# Altium project Servo-Board-v1.0.PrjPcb (part 4 of 19)

## Sheet Connector_Sheet.SchDoc
size 420 x 297 mm; SheetNumber: 8; SheetTotal: 32
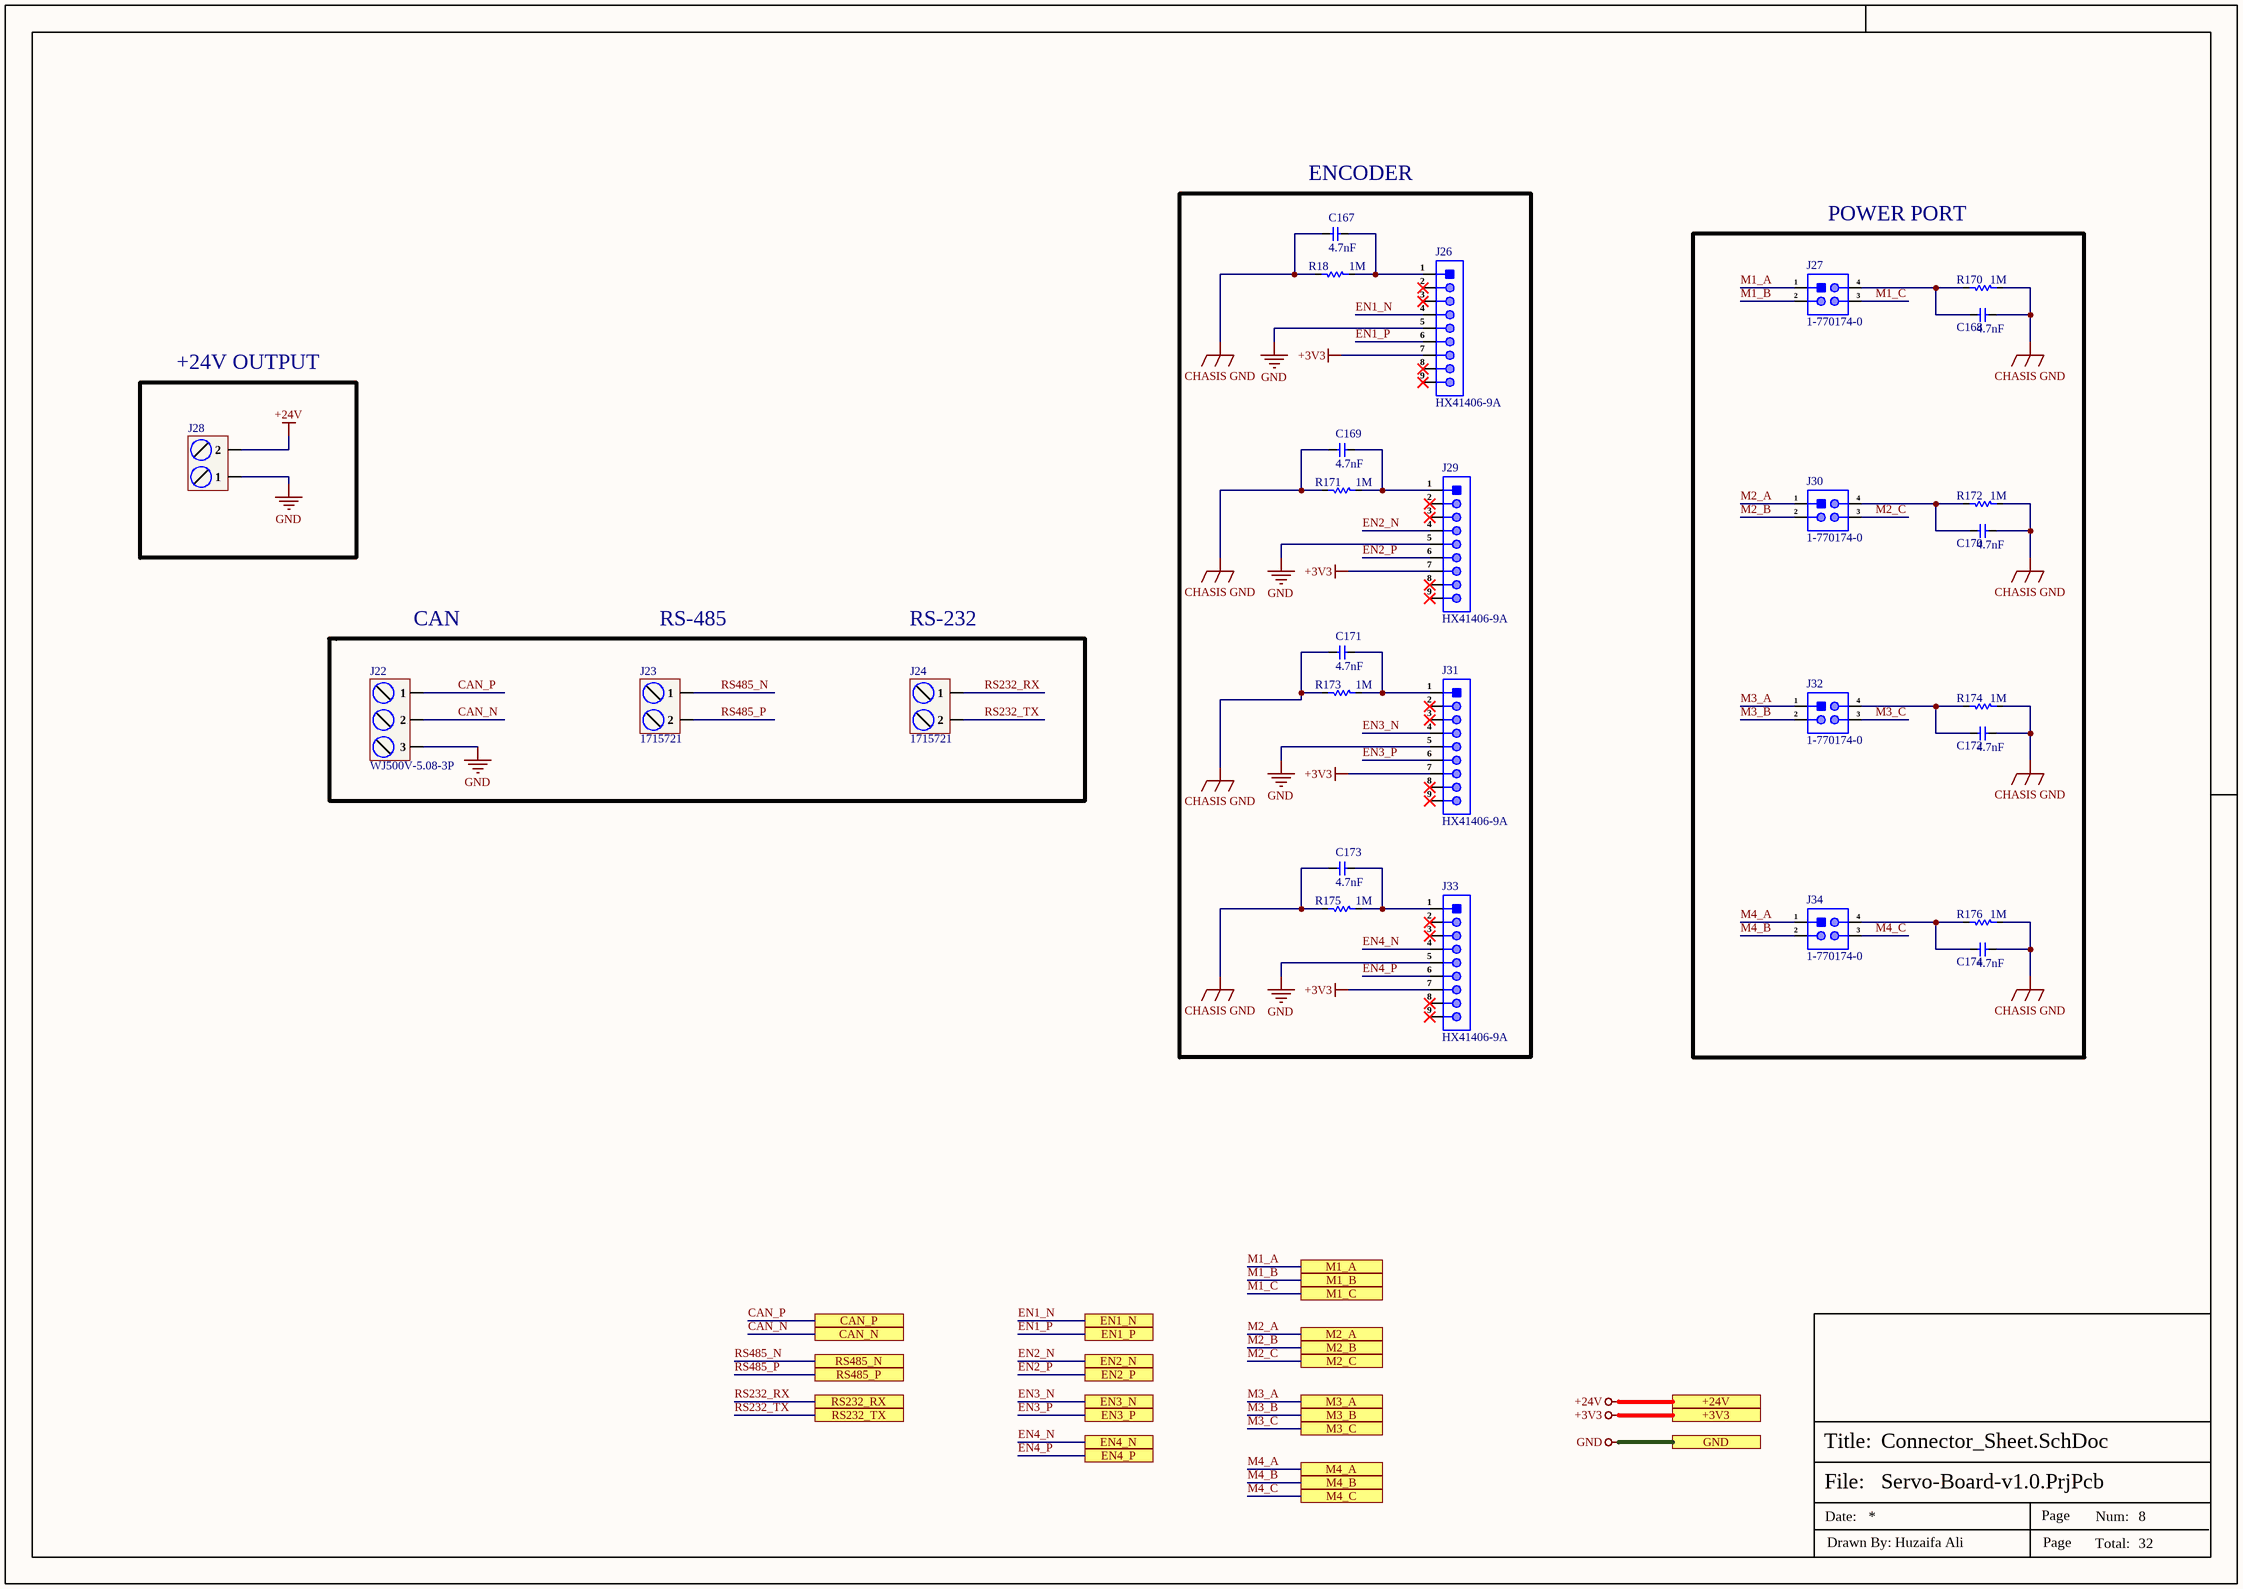
[diagram p7: Connector_Sheet.SchDoc]

### Parts
C167  4.7nF  [Cap-0603]
C168  4.7nF  [Cap-0603]
C169  4.7nF  [Cap-0603]
C170  4.7nF  [Cap-0603]
C171  4.7nF  [Cap-0603]
C172  4.7nF  [Cap-0603]
C173  4.7nF  [Cap-0603]
C174  4.7nF  [Cap-0603]
J22  WJ500V-5.08-3P  [WJ500V-5.08-3P]
J23  1715721  [1715721]
J24  1715721  [1715721]
J26  HX41406-9A  [HX41406-9A]
J27  1-770174-0  [1-770174-0]
J28  MXHB9500-9.5-02P-BK01-Cu-S-A  [MXHB9500-9.5-02P-BK01-Cu-S-A]  (value not drawn)
J29  HX41406-9A  [HX41406-9A]
J30  1-770174-0  [1-770174-0]
J31  HX41406-9A  [HX41406-9A]
J32  1-770174-0  [1-770174-0]
J33  HX41406-9A  [HX41406-9A]
J34  1-770174-0  [1-770174-0]
R18  1M  [Res-0402]
R170  1M  [Res-0402]
R171  1M  [Res-0402]
R172  1M  [Res-0402]
R173  1M  [Res-0402]
R174  1M  [Res-0402]
R175  1M  [Res-0402]
R176  1M  [Res-0402]

### Blocks framed on the sheet
ENCODER: C167 C169 C171 C173 J26 J29 J31 J33 R18 R171 R173 R175
POWER PORT: C168 C170 C172 C174 J27 J30 J32 J34 R170 R172 R174 R176

### Ports
+3V3 (see Top_Sheet[1A], CAN_Sheet[5D], Controller_Sheet[5D], Encoder_Sheet1[5D], Encoder_Sheet2[5D], Encoder_Sheet3[5D], Encoder_Sheet4[5D], EtherCAT_Sheet[5D], Motor_Driver_Sheet1[5D], Motor_Driver_Sheet2[5D], Motor_Driver_Sheet3[5D], Motor_Driver_Sheet4[5D], Power_Sheet[5D], RJ45_Sheet[5D], RS485_RS232_Sheet[3D], Sec_Controller_Sheet1[5D], Sec_Controller_Sheet2[5D], Sec_Controller_Sheet3[5D], Sec_Controller_Sheet4[5D]), +24V (see Top_Sheet[1A], DIO_1[5D], DIO_2[5D], DIO_3[5D], DIO_4[5D], MOSFET_Driver_Sheet1[5D], MOSFET_Driver_Sheet2[5D], MOSFET_Driver_Sheet3[5D], MOSFET_Driver_Sheet4[5D], Motor_Driver_Sheet1[5D], Motor_Driver_Sheet2[5D], Motor_Driver_Sheet3[5D], Motor_Driver_Sheet4[5D], Power_Sheet[5D]), CAN_N, CAN_P, EN1_N (see Top_Sheet[2B], Encoder_Sheet1[2D], Servo1[3D]), EN1_P (see Top_Sheet[2B], Encoder_Sheet1[2D], Servo1[3C]), EN2_N (see Top_Sheet[2B], Encoder_Sheet2[2D], Servo2[2D]), EN2_P (see Top_Sheet[2B], Encoder_Sheet2[2D], Servo2[2C]), EN3_N (see Top_Sheet[2B], Encoder_Sheet3[2D], Servo3[2D]), EN3_P (see Top_Sheet[2B], Encoder_Sheet3[2D], Servo3[2C]), EN4_N (see Top_Sheet[2B], Encoder_Sheet4[2D], Servo4[2D]), EN4_P (see Top_Sheet[2B], Encoder_Sheet4[2D], Servo4[2C]), GND (see Top_Sheet[1A], CAN_Sheet[5D], Controller_Sheet[5D], DIO_1[5D], DIO_2[5D], DIO_3[5D], DIO_4[5D], Encoder_Sheet1[5D], Encoder_Sheet2[5D], Encoder_Sheet3[5D], Encoder_Sheet4[5D], EtherCAT_Sheet[5D], MOSFET_Driver_Sheet1[5D], MOSFET_Driver_Sheet2[5D], MOSFET_Driver_Sheet3[5D], MOSFET_Driver_Sheet4[5D], Motor_Driver_Sheet1[5D], Motor_Driver_Sheet2[5D], Motor_Driver_Sheet3[5D], Motor_Driver_Sheet4[5D], Power_Sheet[5D], RJ45_Sheet[5D], RS485_RS232_Sheet[3D], Sec_Controller_Sheet1[5D], Sec_Controller_Sheet2[5D], Sec_Controller_Sheet3[5D], Sec_Controller_Sheet4[5D]), M1_A (see Top_Sheet[1B], MOSFET_Driver_Sheet1[4D], Servo1[5B]), M1_B (see Top_Sheet[1B], MOSFET_Driver_Sheet1[4D], Servo1[5B]), M1_C (see Top_Sheet[1B], MOSFET_Driver_Sheet1[4D], Servo1[5B]), M2_A (see Top_Sheet[1B], MOSFET_Driver_Sheet2[3D], Servo2[5B]), M2_B (see Top_Sheet[1B], MOSFET_Driver_Sheet2[3D], Servo2[5B]), M2_C (see Top_Sheet[1B], MOSFET_Driver_Sheet2[3D], Servo2[5B]), M3_A (see Top_Sheet[1B], MOSFET_Driver_Sheet3[3D], Servo3[5B]), M3_B (see Top_Sheet[1B], MOSFET_Driver_Sheet3[3D], Servo3[5B]), M3_C (see Top_Sheet[1B], MOSFET_Driver_Sheet3[3D], Servo3[5B]), M4_A (see Top_Sheet[1B], MOSFET_Driver_Sheet4[3D], Servo4[5B]), M4_B (see Top_Sheet[1B], MOSFET_Driver_Sheet4[3D], Servo4[5B]), M4_C (see Top_Sheet[1B], MOSFET_Driver_Sheet4[3D], Servo4[5B]), RS232_RX (see Top_Sheet[1A], RS485_RS232_Sheet[5D]), RS232_TX (see Top_Sheet[1A], RS485_RS232_Sheet[5D]), RS485_N (see Top_Sheet[1A], RS485_RS232_Sheet[5D]), RS485_P (see Top_Sheet[1A], RS485_RS232_Sheet[5D])

### Nets
+3V3: J26.7 J29.7 J31.7 J33.7 ; port +3V3
+24V: J28.2 ; port +24V  [project net VDRAIN]
CHASIS GND: C167.2 C168.2 C169.2 C170.2 C171.2 C172.2 C173.2 C174.2 R18.1 R170.2 R171.1 R172.2 R173.1 R174.2 R175.1 R176.2
GND: J22.3 J26.5 J28.1 J29.5 J31.5 J33.5 ; port GND
RS232_RX: J24.1 ; port RS232_RX
RS232_TX: J24.2 ; port RS232_TX
CAN_N: J22.2 ; port CAN_N
CAN_P: J22.1 ; port CAN_P
EN1_N: J26.4 ; port EN1_N
EN1_P: J26.6 ; port EN1_P
EN2_N: J29.4 ; port EN2_N
EN2_P: J29.6 ; port EN2_P
EN3_N: J31.4 ; port EN3_N
EN3_P: J31.6 ; port EN3_P
EN4_N: J33.4 ; port EN4_N
EN4_P: J33.6 ; port EN4_P
M1_A: J27.1 ; port M1_A
M1_B: J27.2 ; port M1_B
M1_C: J27.3 ; port M1_C
M2_A: J30.1 ; port M2_A
M2_B: J30.2 ; port M2_B
M2_C: J30.3 ; port M2_C
M3_A: J32.1 ; port M3_A
M3_B: J32.2 ; port M3_B
M3_C: J32.3 ; port M3_C
M4_A: J34.1 ; port M4_A
M4_B: J34.2 ; port M4_B
M4_C: J34.3 ; port M4_C
RS485_N: J23.1 ; port RS485_N
RS485_P: J23.2 ; port RS485_P
NetC167_1: C167.1 J26.1 R18.2
NetC168_1: C168.1 J27.4 R170.1
NetC169_1: C169.1 J29.1 R171.2
NetC170_1: C170.1 J30.4 R172.1
NetC171_1: C171.1 J31.1 R173.2
NetC172_1: C172.1 J32.4 R174.1
NetC173_1: C173.1 J33.1 R175.2
NetC174_1: C174.1 J34.4 R176.1

Not connected (* = marked no-connect by the designer): J26 2* 3* 8* 9*; J29 2* 3* 8* 9*; J31 2* 3* 8* 9*; J33 2* 3* 8* 9*

### Notes on the sheet
- +24V OUTPUT
- CAN
- RS-485
- RS-232
- File:
- Title:
- Date:
- Page
- Num:
- Total:
- Drawn By: Huzaifa Ali

### Library data of the parts
C167-C174 = CC0603JRNPO9BN472: CAP CER 4700PF 50V C0G/NPO 0603; Manufacturer: Yageo; Item Type: Capacitor; Supplier 1: Digi-Key; Manufacturer Part Number: CC0603JRNPO9BN472; RoHS: Yes; Category: Ceramic Capacitors; Stock 1: 31779; Pricing 1: 1=0.48000, 10=0.33000, 50=0.23100, 100=0.19800, 500=0.14854, 1000=0.12543 (USD); RoHS Compliant: Yes; Supplier Part Number 1: 13-CC0603JRNPO9BN472CT-ND; LCSC Part Number: C576818; ComponentLink1Description: LCSC; ComponentLink1URL: https://www.lcsc.com/product-detail/Multilayer-Ceramic-Capacitors-MLCC-SMD-SMT_YAGEO-CC0603JRNPO9BN472_C576818.html
J22 = WJ500V-5.08-3P: 1x3P 18A -40℃~+105℃ 250V Green 14~30 Straight pin 5.08mm 2.5 1 3 Plugin,P=5.08mm Screw terminal ROHS; Manufacturer: Ningbo Kangnex Elec; Item Type: Terminal Block; Manufacturer Part Number: WJ500V-5.08-3P; Package: Plugin,P=5.08mm; LCSC Part Number: C72334; ComponentLink1Description: LCSC; ComponentLink1URL: https://www.lcsc.com/product-detail/Screw-terminal_Ningbo-Kangnex-Elec-WJ500V-5-08-3P_C72334.html
J23 J24 = 1715721: TERM BLK 2P SIDE ENT 5.08MM PCB; Manufacturer: Phoenix Contact; Item Type: Terminal Blocks; Supplier: Digikey; Supplier Part Number: 277-1263-ND; Manufacturer Part Number: 1715721; RoHS: Yes; Stock: 13160; Pricing: 1=0.94 (USD); ComponentLink1URL: https://datasheet.ciiva.com/1120/1697161-1120393.pdf?src-supplier=Farnell; ComponentLink1Description: https://datasheet.ciiva.com/1120/1697161-1120393.pdf?src-supplier=Farnell; ComponentLink2URL: https://datasheet.ciiva.com/832/1715721-832095.pdf?src-supplier=Digikey; ComponentLink2Description: https://datasheet.ciiva.com/832/1715721-832095.pdf?src-supplier=Digikey; ComponentLink3URL: https://datasheet.ciiva.com/15169/getdatasheetpartid-212174-15169929.pdf?src-supplier=Verical; ComponentLink3Description: https://datasheet.ciiva.com/15169/getdatasheetpartid-212174-15169929.pdf?src-supplier=Verical; ComponentLink4URL: https://datasheet.ciiva.com/16046/1715721-16046034.pdf?src-supplier=Onlinecomponents.com; ComponentLink4Description: https://datasheet.ciiva.com/16046/1715721-16046034.pdf?src-supplier=Onlinecomponents.com
J26 J29 J31 J33 = HX41406-9A: 3x3P 9P 3 4.14mm 4.14mm 3 -25℃~+105℃ 8A Straight Plugin,P=4.14mm Wire To Board Connector ROHS; Manufacturer: HX(Zhejiang Yueqing Hongxing Elec); Manufacturer Part Number: HX41406-9A; Package: Plugin,P=4.14mm; LCSC Part Number: C704507; Item Type: Wire To Board Connector; ComponentLink1Description: LCSC; ComponentLink1URL: https://www.lcsc.com/product-detail/Wire-To-Board-Connector_HX-Zhejiang-Yueqing-Hongxing-Elec-HX41406-9A_C704507.html
J27 J30 J32 J34 = 1-770174-0: CONN HEADER VERT 4POS 4.14MM; Manufacturer: TE Connectivity; Item Type: Power Connectors; Supplier: Future Electronics; Supplier Part Number: 3310547; Manufacturer Part Number: 1-770174-0; RoHS: Yes; Stock: 890; Pricing: 1=0.995, 30=1.04, 40=0.945, 125=0.91, 300=0.95, 400=0.87, 1250=0.8 (USD); ComponentLink1URL: https://datasheet.ciiva.com/19460/746478-19460823.pdf?src-supplier=Jameco; ComponentLink1Description: https://datasheet.ciiva.com/19460/746478-19460823.pdf?src-supplier=Jameco; ComponentLink2URL: https://datasheet.ciiva.com/11755/0900766b80b8608c-11755178.pdf?src-supplier=Rs; ComponentLink2Description: https://datasheet.ciiva.com/11755/0900766b80b8608c-11755178.pdf?src-supplier=Rs; ComponentLink3URL: https://datasheet.ciiva.com/16324/eng-cs-82181-softshell-high-density-0508-16324224.pdf?src-supplier=Future+Electronics; ComponentLink3Description: https://datasheet.ciiva.com/16324/eng-cs-82181-softshell-high-density-0508-16324224.pdf?src-supplier=Future+Electronics; ComponentLink4URL: https://datasheet.ciiva.com/1111/eng-cd-770174-l2-1111782.pdf?src-supplier=Element14; ComponentLink4Description: https://datasheet.ciiva.com/1111/eng-cd-770174-l2-1111782.pdf?src-supplier=Element14; ComponentLink5URL: https://datasheet.ciiva.com/15173/getdatasheetpartid-47574-15173655.pdf?src-supplier=Verical; ComponentLink5Description: https://datasheet.ciiva.com/15173/getdatasheetpartid-47574-15173655.pdf?src-supplier=Verical; ComponentLink6URL: https://datasheet.ciiva.com/710/eng-cd-770174-m-710026.pdf?src-supplier=Digikey; ComponentLink6Description: https://datasheet.ciiva.com/710/eng-cd-770174-m-710026.pdf?src-supplier=Digikey; ComponentLink7URL: https://datasheet.ciiva.com/3126/eng-cs-82181-softshell-high-density-0408-3126092.pdf?src-supplier=Avnet; ComponentLink7Description: https://datasheet.ciiva.com/3126/eng-cs-82181-softshell-high-density-0408-3126092.pdf?src-supplier=Avnet; ComponentLink8URL: https://datasheet.ciiva.com/30189/eng-cs-82181-softshell-high-density-0508-30189644.pdf?src-supplier=Onlinecomponents.com; ComponentLink8Description: https://datasheet.ciiva.com/30189/eng-cs-82181-softshell-high-density-0508-30189644.pdf?src-supplier=Onlinecomponents.com; ComponentLink9URL: https://datasheet.ciiva.com/29266/745091-da-01-en-4-pol-mini-univ-mate-n-lok-stecksockel-29266107.pdf?src-supplier=Conrad; ComponentLink9Description: https://datasheet.ciiva.com/29266/745091-da-01-en-4-pol-mini-univ-mate-n-lok-stecksockel-29266107.pdf?src-supplier=Conrad
J28 = MXHB9500-9.5-02P-BK01-Cu-S-A: Tin 1x2P Corner pin Three sides 2 1 9.5mm -40℃~+105℃ 20A 300V Black 10~22 Copper Alloy 0.5~4 Plugin,P=9.5mm Barrier Terminal Blocks ROHS; Manufacturer: MAX; Manufacturer Part Number: MXHB9500-9.5-02P-BK01-Cu-S-A; Package: Plugin,P=9.5mm; LCSC Part Number: C7542168; Item Type: Terminal Block; ComponentLink1Description: LCSC; ComponentLink1URL: https://www.lcsc.com/product-detail/Barrier-Terminal-Blocks_MAX-MXHB9500-9-5-02P-BK01-Cu-S-A_C7542168.html
R18 R170-R176 = AF0402JR-071ML: RES SMD 1M OHM 5% 1/16W 0402; Manufacturer: Yageo; Resistance: 1MR; Max Power Dissipation: 63mW; Temperature Coefficient: 100ppm/°C; Item Type: Resistor; Supplier 1: Digi-Key; Manufacturer Part Number: AF0402JR-071ML; Stock 1: 0; Pricing 1: 10000=0.00408 (USD); Case/Package: 0402; Min Operating Temperature: -55°C; Max Operating Temperature: 155°C; Packaging: Tape and Reel; Resistor Type: Thick Film; Number of Terminations: 2; Tolerance: 5%; Features: Moisture Resistant,Anti-Sulfur; Length: 0.039inch; Width: 0.02inch; Height: 0.015inch; RoHS Compliant: Yes; ComponentLink1URL: https://www.yageo.com/upload/media/product/productsearch/datasheet/rchip/PYu-AF_51_RoHS_L_6.pdf?src-supplier=Digi-Key; ComponentLink1Description: https://www.yageo.com/upload/media/product/productsearch/datasheet/rchip/PYu-AF_51_RoHS_L_6.pdf?src-supplier=Digi-Key; Supplier Part Number 1: AF0402JR-071ML-ND; LCSC Part Number: C144054

## Sheet Servo1.SchDoc
size 420 x 297 mm; SheetNumber: 9; SheetTotal: 32
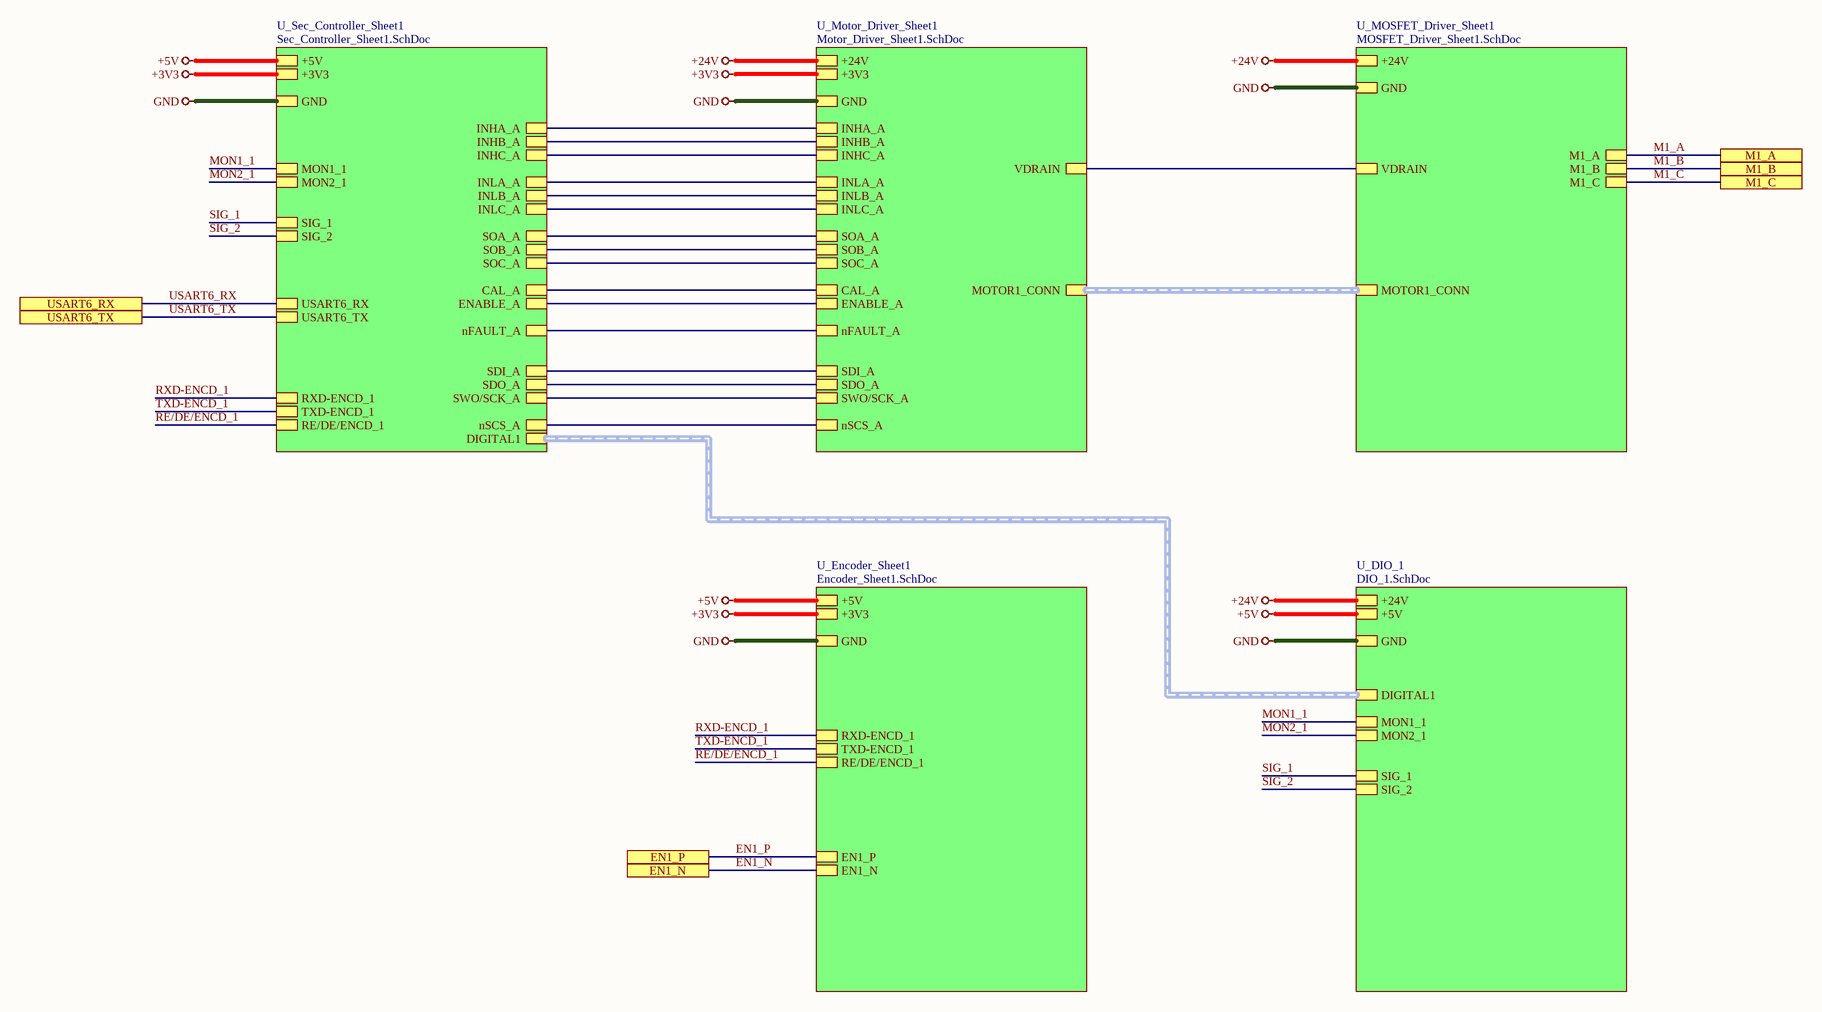
[diagram p8: Servo1.SchDoc]

### Sub-sheets
U_DIO_1 = DIO_1.SchDoc: +24V, +5V, GND, MON1_1, MON2_1, SIG_1, SIG_2, DIGITAL1 (harness DIGITAL1)
U_Encoder_Sheet1 = Encoder_Sheet1.SchDoc: +3V3, +5V, GND, RXD-ENCD_1, TXD-ENCD_1, RE/DE/ENCD_1, EN1_N, EN1_P
U_MOSFET_Driver_Sheet1 = MOSFET_Driver_Sheet1.SchDoc: +24V, GND, M1_A, M1_B, M1_C, MOTOR1_CONN (harness MOTOR1_CONN), VDRAIN
U_Motor_Driver_Sheet1 = Motor_Driver_Sheet1.SchDoc: +24V, +3V3, GND, MOTOR1_CONN (harness MOTOR1_CONN), INHA_A, INHB_A, INHC_A, INLA_A, INLB_A, INLC_A, nSCS_A, SDI_A, SDO_A, SWO/SCK_A, SOC_A, SOB_A, SOA_A, CAL_A, ENABLE_A, VDRAIN, nFAULT_A
U_Sec_Controller_Sheet1 = Sec_Controller_Sheet1.SchDoc: +3V3, GND, INHA_A, INHB_A, INHC_A, INLA_A, INLB_A, INLC_A, nSCS_A, SDI_A, SDO_A, SWO/SCK_A, SOC_A, SOB_A, SOA_A, CAL_A, ENABLE_A, nFAULT_A, USART6_RX, USART6_TX, RXD-ENCD_1, TXD-ENCD_1, RE/DE/ENCD_1, MON1_1, MON2_1, SIG_1, SIG_2, DIGITAL1 (harness DIGITAL1), +5V

### Ports
EN1_N (see Top_Sheet[4A], Connector_Sheet[3D], Encoder_Sheet1[2D]), EN1_P (see Top_Sheet[4A], Connector_Sheet[3D], Encoder_Sheet1[2D]), M1_A (see Top_Sheet[4B], Connector_Sheet[4D], MOSFET_Driver_Sheet1[4D]), M1_B (see Top_Sheet[4B], Connector_Sheet[4D], MOSFET_Driver_Sheet1[4D]), M1_C (see Top_Sheet[4B], Connector_Sheet[4D], MOSFET_Driver_Sheet1[4D]), USART6_RX (see Top_Sheet[4A], Controller_Sheet[2D], Sec_Controller_Sheet1[1D]), USART6_TX (see Top_Sheet[4A], Controller_Sheet[2D], Sec_Controller_Sheet1[1D])

### Nets
+3V3: sheet U_Sec_Controller_Sheet1/+3V3, sheet U_Motor_Driver_Sheet1/+3V3, sheet U_Encoder_Sheet1/+3V3
+5V: sheet U_Sec_Controller_Sheet1/+5V, sheet U_Encoder_Sheet1/+5V, sheet U_DIO_1/+5V
+24V: sheet U_Motor_Driver_Sheet1/+24V, sheet U_Motor_Driver_Sheet1/VDRAIN, sheet U_MOSFET_Driver_Sheet1/+24V, sheet U_MOSFET_Driver_Sheet1/VDRAIN, sheet U_DIO_1/+24V  [project net VDRAIN]
GND: sheet U_Sec_Controller_Sheet1/GND, sheet U_Motor_Driver_Sheet1/GND, sheet U_MOSFET_Driver_Sheet1/GND, sheet U_Encoder_Sheet1/GND, sheet U_DIO_1/GND
CAL_A: sheet U_Sec_Controller_Sheet1/CAL_A, sheet U_Motor_Driver_Sheet1/CAL_A
EN1_N: port EN1_N, sheet U_Encoder_Sheet1/EN1_N
EN1_P: port EN1_P, sheet U_Encoder_Sheet1/EN1_P
ENABLE_A: sheet U_Sec_Controller_Sheet1/ENABLE_A, sheet U_Motor_Driver_Sheet1/ENABLE_A
INHA_A: sheet U_Sec_Controller_Sheet1/INHA_A, sheet U_Motor_Driver_Sheet1/INHA_A
INHB_A: sheet U_Sec_Controller_Sheet1/INHB_A, sheet U_Motor_Driver_Sheet1/INHB_A
INHC_A: sheet U_Sec_Controller_Sheet1/INHC_A, sheet U_Motor_Driver_Sheet1/INHC_A
INLA_A: sheet U_Sec_Controller_Sheet1/INLA_A, sheet U_Motor_Driver_Sheet1/INLA_A
INLB_A: sheet U_Sec_Controller_Sheet1/INLB_A, sheet U_Motor_Driver_Sheet1/INLB_A
INLC_A: sheet U_Sec_Controller_Sheet1/INLC_A, sheet U_Motor_Driver_Sheet1/INLC_A
M1_A: port M1_A, sheet U_MOSFET_Driver_Sheet1/M1_A
M1_B: port M1_B, sheet U_MOSFET_Driver_Sheet1/M1_B
M1_C: port M1_C, sheet U_MOSFET_Driver_Sheet1/M1_C
MON1_1: sheet U_Sec_Controller_Sheet1/MON1_1, sheet U_DIO_1/MON1_1
MON2_1: sheet U_Sec_Controller_Sheet1/MON2_1, sheet U_DIO_1/MON2_1
nFAULT_A: sheet U_Sec_Controller_Sheet1/nFAULT_A, sheet U_Motor_Driver_Sheet1/nFAULT_A
nSCS_A: sheet U_Sec_Controller_Sheet1/nSCS_A, sheet U_Motor_Driver_Sheet1/nSCS_A
RE/DE/ENCD_1: sheet U_Sec_Controller_Sheet1/RE/DE/ENCD_1, sheet U_Encoder_Sheet1/RE/DE/ENCD_1
RXD-ENCD_1: sheet U_Sec_Controller_Sheet1/RXD-ENCD_1, sheet U_Encoder_Sheet1/RXD-ENCD_1
SDI_A: sheet U_Sec_Controller_Sheet1/SDI_A, sheet U_Motor_Driver_Sheet1/SDI_A
SDO_A: sheet U_Sec_Controller_Sheet1/SDO_A, sheet U_Motor_Driver_Sheet1/SDO_A
SIG_1: sheet U_Sec_Controller_Sheet1/SIG_1, sheet U_DIO_1/SIG_1
SIG_2: sheet U_Sec_Controller_Sheet1/SIG_2, sheet U_DIO_1/SIG_2
SOA_A: sheet U_Sec_Controller_Sheet1/SOA_A, sheet U_Motor_Driver_Sheet1/SOA_A
SOB_A: sheet U_Sec_Controller_Sheet1/SOB_A, sheet U_Motor_Driver_Sheet1/SOB_A
SOC_A: sheet U_Sec_Controller_Sheet1/SOC_A, sheet U_Motor_Driver_Sheet1/SOC_A
SWO/SCK_A: sheet U_Sec_Controller_Sheet1/SWO/SCK_A, sheet U_Motor_Driver_Sheet1/SWO/SCK_A
TXD-ENCD_1: sheet U_Sec_Controller_Sheet1/TXD-ENCD_1, sheet U_Encoder_Sheet1/TXD-ENCD_1
USART6_RX: port USART6_RX, sheet U_Sec_Controller_Sheet1/USART6_RX
USART6_TX: port USART6_TX, sheet U_Sec_Controller_Sheet1/USART6_TX

### Buses and harness runs
harness sheet U_DIO_1/DIGITAL1 = sheet U_Sec_Controller_Sheet1/DIGITAL1
harness sheet U_MOSFET_Driver_Sheet1/MOTOR1_CONN = sheet U_Motor_Driver_Sheet1/MOTOR1_CONN

### Notes on the sheet
- File:
- Title:
- Date:
- Page
- Num:
- Total:
- Drawn By: Huzaifa Ali

## Sheet Sec_Controller_Sheet1.SchDoc
size 420 x 297 mm; SheetNumber: 10; SheetTotal: 32
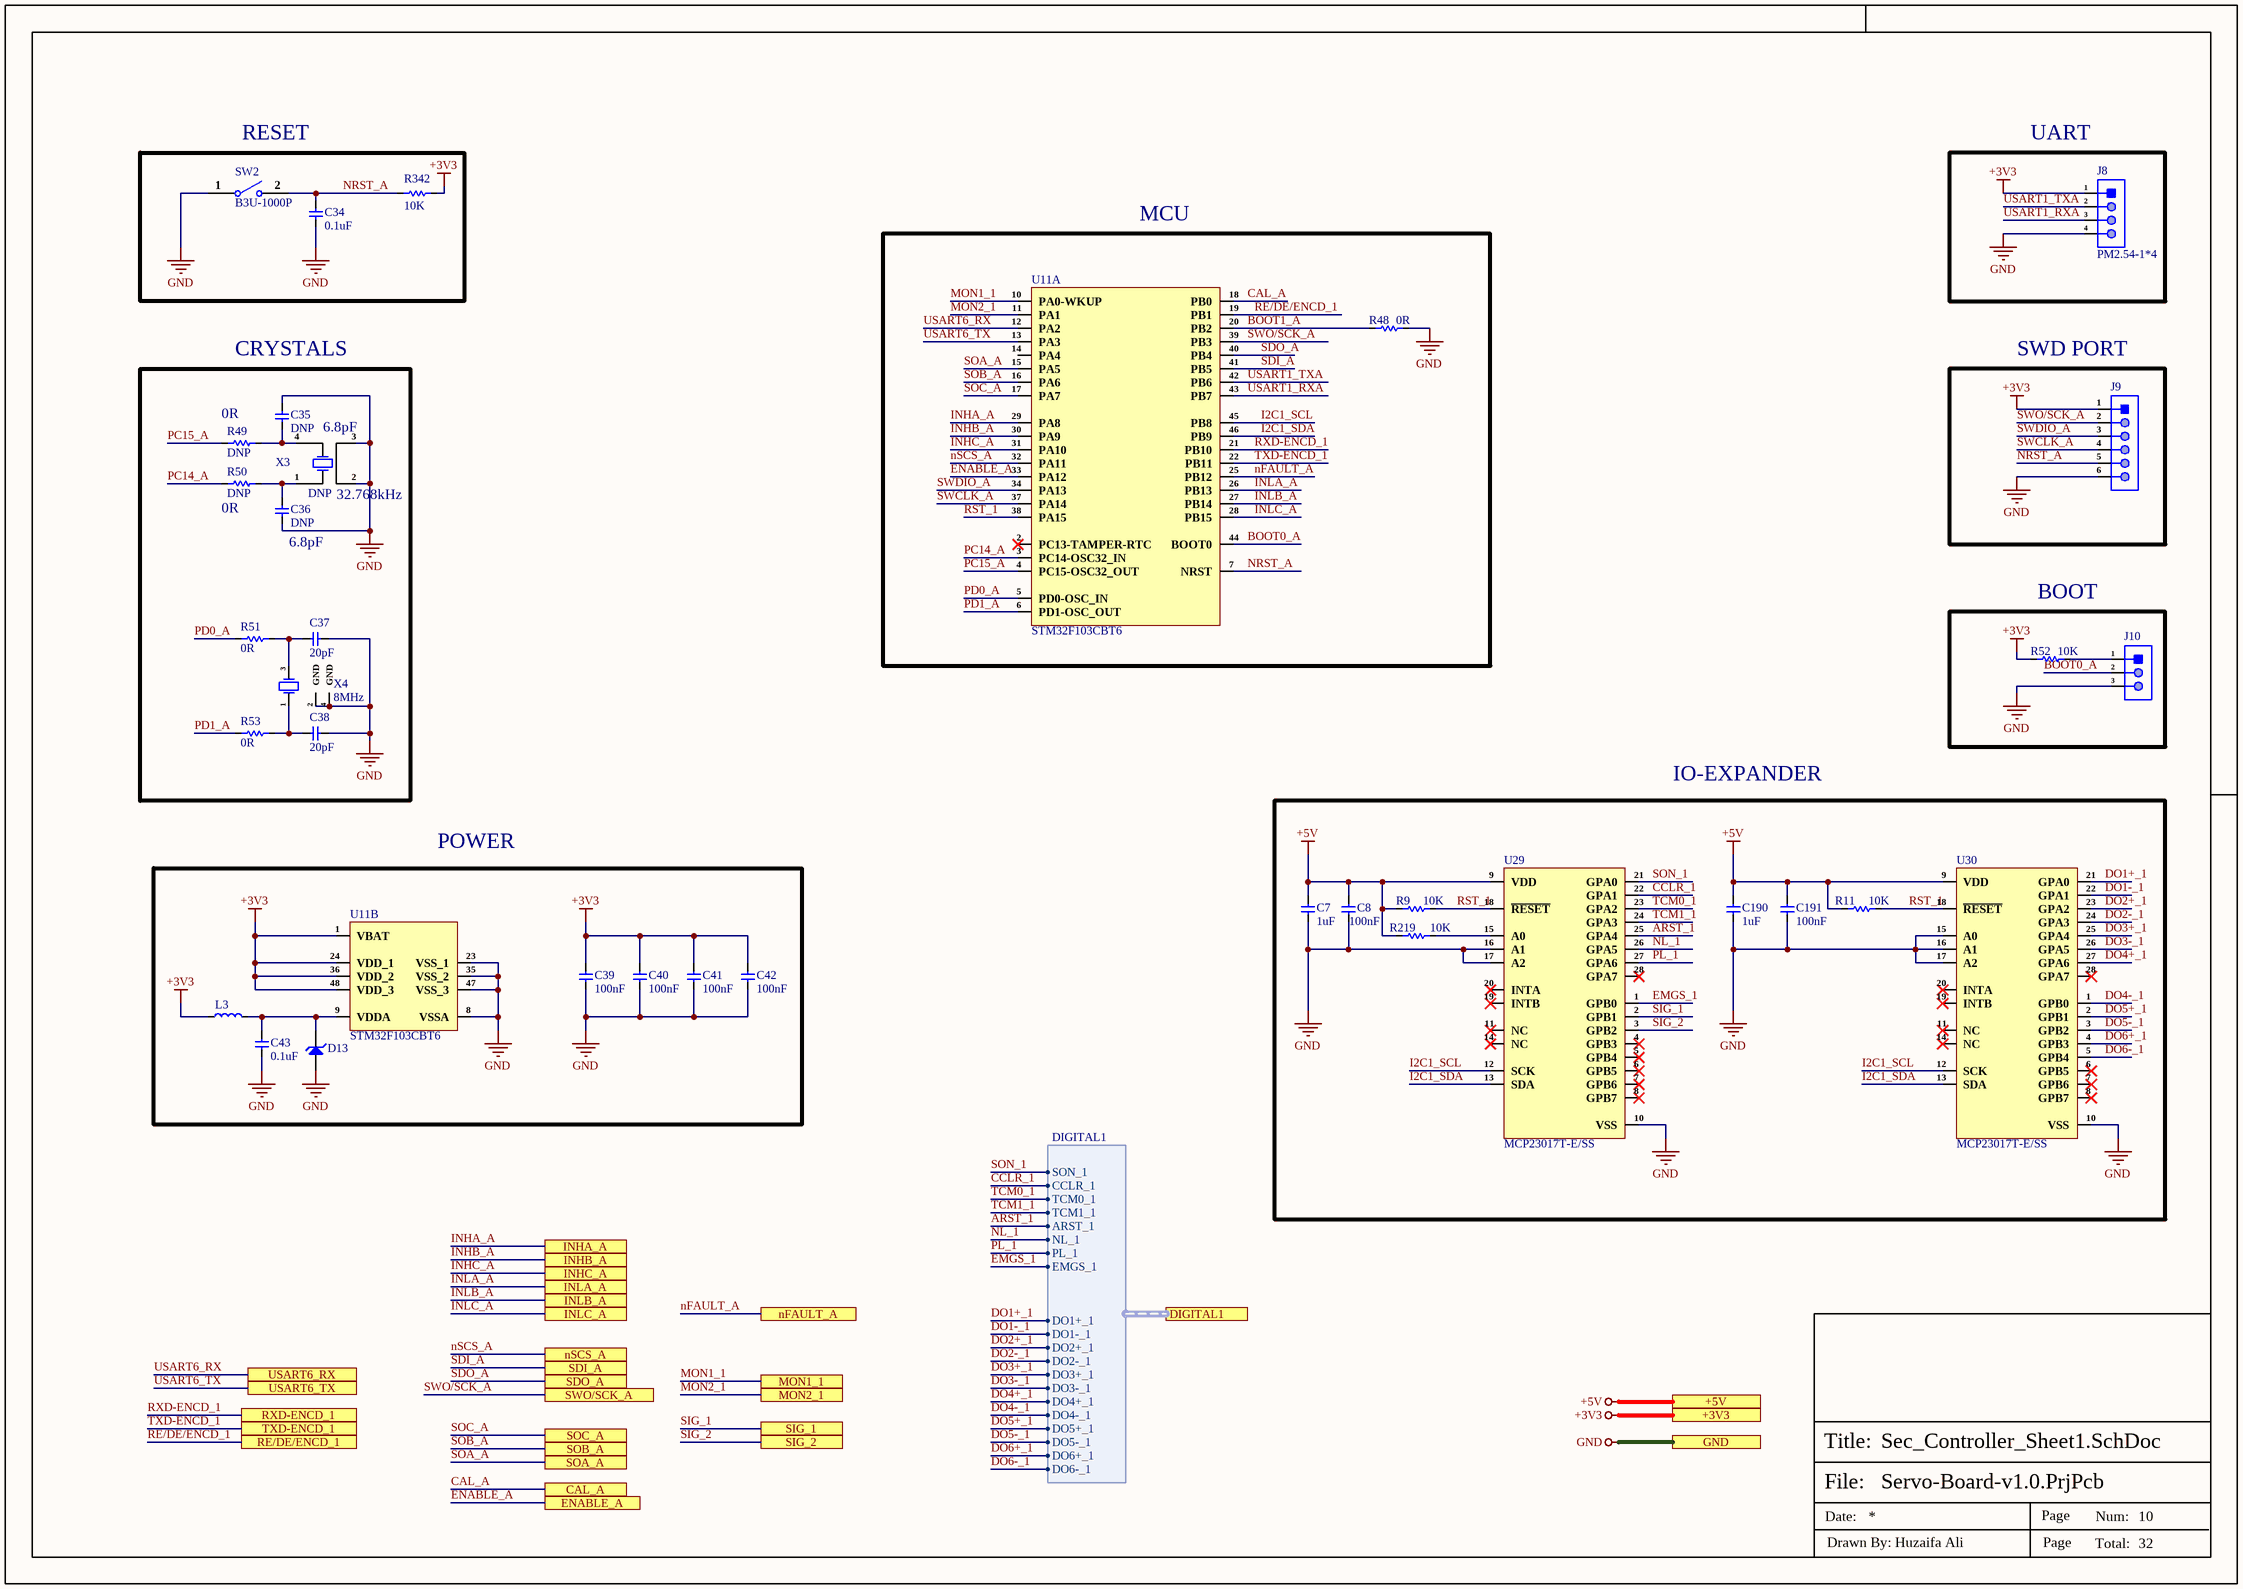
[diagram p9: Sec_Controller_Sheet1.SchDoc]

### Parts
C7  1uF  [Cap-0402]
C8  100nF  [cap-0402]
C34  0.1uF  [Cap-0402]
C35  DNP  [Cap-0402]
C36  DNP  [Cap-0402]
C37  20pF  [Cap-0402]
C38  20pF  [Cap-0402]
C39  100nF  [cap-0402]
C40  100nF  [cap-0402]
C41  100nF  [cap-0402]
C42  100nF  [cap-0402]
C43  0.1uF  [Cap-0402]
C190  1uF  [Cap-0402]
C191  100nF  [cap-0402]
D13  AZ3003-01G  [SOD-123]  (value not drawn)
J8  PM2.54-1*4  [HDR1X4 Female]
J9  X6511WV-06H-C60D30  [HDR1X6_]  (value not drawn)
J10  68000-103HLF  [HDR1X3_]  (value not drawn)
L3  BLM15AG601SN1D  [IND-0402]  (value not drawn)
R9  10K  [Res-0402]
R11  10K  [Res-0402]
R48  0R  [Res-0402]
R49  DNP  [Res-0603]
R50  DNP  [Res-0603]
R51  0R  [Res-0603]
R52  10K  [Res-0402]
R53  0R  [Res-0603]
R219  10K  [Res-0402]
R342  10K  [Res-0402]
SW2  B3U-1000P  [B3U-1000P]
U11  STM32F103CBT6  [48-LQFP (7x7)_]  (parts A,B of 2)
U29  MCP23017T-E/SS  [SSOP-28-208mil]
U30  MCP23017T-E/SS  [SSOP-28-208mil]
X3  DNP  [MC-306]
X4  8MHz  [5TJ480000XYLBC_]

### Blocks framed on the sheet
RESET: C34 R342 SW2
UART: J8
MCU: R48 U11
CRYSTALS: C35-C38 R49-R51 R53 X3 X4
SWD PORT: J9
BOOT: J10 R52
IO-EXPANDER: C7 C8 C190 C191 R9 R11 R219 U29 U30
POWER: C39-C43 D13 L3 U11

### Ports
+3V3 (see Servo1[2A], CAN_Sheet[5D], Connector_Sheet[5D], Controller_Sheet[5D], Encoder_Sheet1[5D], Encoder_Sheet2[5D], Encoder_Sheet3[5D], Encoder_Sheet4[5D], EtherCAT_Sheet[5D], Motor_Driver_Sheet1[5D], Motor_Driver_Sheet2[5D], Motor_Driver_Sheet3[5D], Motor_Driver_Sheet4[5D], Power_Sheet[5D], RJ45_Sheet[5D], RS485_RS232_Sheet[3D], Sec_Controller_Sheet2[5D], Sec_Controller_Sheet3[5D], Sec_Controller_Sheet4[5D]), +5V, CAL_A (see Servo1[2B], Motor_Driver_Sheet1[3D]), DIGITAL1 (harness DIGITAL1, see Servo1[2B], DIO_1[4D]), ENABLE_A (see Servo1[2B], Motor_Driver_Sheet1[3D]), GND (see Servo1[2B], CAN_Sheet[5D], Connector_Sheet[5D], Controller_Sheet[5D], DIO_1[5D], DIO_2[5D], DIO_3[5D], DIO_4[5D], Encoder_Sheet1[5D], Encoder_Sheet2[5D], Encoder_Sheet3[5D], Encoder_Sheet4[5D], EtherCAT_Sheet[5D], MOSFET_Driver_Sheet1[5D], MOSFET_Driver_Sheet2[5D], MOSFET_Driver_Sheet3[5D], MOSFET_Driver_Sheet4[5D], Motor_Driver_Sheet1[5D], Motor_Driver_Sheet2[5D], Motor_Driver_Sheet3[5D], Motor_Driver_Sheet4[5D], Power_Sheet[5D], RJ45_Sheet[5D], RS485_RS232_Sheet[3D], Sec_Controller_Sheet2[5D], Sec_Controller_Sheet3[5D], Sec_Controller_Sheet4[5D]), INHA_A (see Servo1[2B], Motor_Driver_Sheet1[3D]), INHB_A (see Servo1[2B], Motor_Driver_Sheet1[3D]), INHC_A (see Servo1[2B], Motor_Driver_Sheet1[3D]), INLA_A (see Servo1[2B], Motor_Driver_Sheet1[3D]), INLB_A (see Servo1[2B], Motor_Driver_Sheet1[3D]), INLC_A (see Servo1[2B], Motor_Driver_Sheet1[3D]), MON1_1 (see Servo1[2B], DIO_1[3D]), MON2_1 (see Servo1[2B], DIO_1[3D]), nFAULT_A (see Servo1[2B], Motor_Driver_Sheet1[3D]), nSCS_A (see Servo1[2B], Motor_Driver_Sheet1[3D]), RE/DE/ENCD_1 (see Servo1[2B], Encoder_Sheet1[3D]), RXD-ENCD_1 (see Servo1[2B], Encoder_Sheet1[3D]), SDI_A (see Servo1[2B], Motor_Driver_Sheet1[3D]), SDO_A (see Servo1[2B], Motor_Driver_Sheet1[3D]), SIG_1 (see Servo1[2B], DIO_1[2D]), SIG_2 (see Servo1[2B], DIO_1[2D]), SOA_A (see Servo1[2B], Motor_Driver_Sheet1[3D]), SOB_A (see Servo1[2B], Motor_Driver_Sheet1[3D]), SOC_A (see Servo1[2B], Motor_Driver_Sheet1[3D]), SWO/SCK_A (see Servo1[2B], Motor_Driver_Sheet1[3D]), TXD-ENCD_1 (see Servo1[2B], Encoder_Sheet1[3D]), USART6_RX (see Servo1[2B], Controller_Sheet[2D], Servo1[1B]), USART6_TX (see Servo1[2B], Controller_Sheet[2D], Servo1[1B])

### Harnesses
DIGITAL1: SON_1, TCM0_1, CCLR_1, TCM1_1, ARST_1, NL_1, PL_1, EMGS_1, DO1+_1, DO1-_1, DO2+_1, DO2-_1, DO3+_1, DO3-_1, DO4+_1, DO4-_1, DO5+_1, DO5-_1, DO6+_1, DO6-_1

### Nets
+3V3: C39.2 C40.2 C41.2 C42.2 J8.1 J9.1 L3.1 R52.2 R342.2 U11.1(VBAT) U11.24(VDD_1) U11.36(VDD_2) U11.48(VDD_3) ; port +3V3
+5V: C7.2 C8.2 C190.2 C191.2 R9.2 R11.2 R219.2 U29.9(VDD) U30.9(VDD) ; port +5V
GND: C7.1 C8.1 C34.1 C35.2 C36.1 C37.2 C38.2 C39.1 C40.1 C41.1 C42.1 C43.1 C190.1 C191.1 D13.1(A) J8.4 J9.6 J10.3 R48.2 SW2.1 U11.8(VSSA) U11.23(VSS_1) U11.35(VSS_2) U11.47(VSS_3) U29.10(VSS) U29.16(A1) U29.17(A2) U30.10(VSS) U30.15(A0) U30.16(A1) U30.17(A2) X3.2 X3.3 X4.2(GND) X4.4(GND) ; port GND
ARST_1: U29.25(GPA4) ; port DIGITAL1.ARST_1
BOOT0_A: J10.2 U11.44(BOOT0)
BOOT1_A: R48.1 U11.20(PB2)
CAL_A: U11.18(PB0) ; port CAL_A
CCLR_1: U29.22(GPA1) ; port DIGITAL1.CCLR_1
DO1+_1: U30.21(GPA0) ; port DIGITAL1.DO1+_1
DO1-_1: U30.22(GPA1) ; port DIGITAL1.DO1-_1
DO2+_1: U30.23(GPA2) ; port DIGITAL1.DO2+_1
DO2-_1: U30.24(GPA3) ; port DIGITAL1.DO2-_1
DO3+_1: U30.25(GPA4) ; port DIGITAL1.DO3+_1
DO3-_1: U30.26(GPA5) ; port DIGITAL1.DO3-_1
DO4+_1: U30.27(GPA6) ; port DIGITAL1.DO4+_1
DO4-_1: U30.1(GPB0) ; port DIGITAL1.DO4-_1
DO5+_1: U30.2(GPB1) ; port DIGITAL1.DO5+_1
DO5-_1: U30.3(GPB2) ; port DIGITAL1.DO5-_1
DO6+_1: U30.4(GPB3) ; port DIGITAL1.DO6+_1
DO6-_1: U30.5(GPB4) ; port DIGITAL1.DO6-_1
EMGS_1: U29.1(GPB0) ; port DIGITAL1.EMGS_1
ENABLE_A: U11.33(PA12) ; port ENABLE_A
I2C1_SCL: U11.45(PB8) U29.12(SCK) U30.12(SCK)
I2C1_SDA: U11.46(PB9) U29.13(SDA) U30.13(SDA)
INHA_A: U11.29(PA8) ; port INHA_A
INHB_A: U11.30(PA9) ; port INHB_A
INHC_A: U11.31(PA10) ; port INHC_A
INLA_A: U11.26(PB13) ; port INLA_A
INLB_A: U11.27(PB14) ; port INLB_A
INLC_A: U11.28(PB15) ; port INLC_A
MON1_1: U11.10(PA0-WKUP) ; port MON1_1
MON2_1: U11.11(PA1) ; port MON2_1
nFAULT_A: U11.25(PB12) ; port nFAULT_A
NL_1: U29.26(GPA5) ; port DIGITAL1.NL_1
NRST_A: C34.2 J9.5 R342.1 SW2.2 U11.7(NRST)
nSCS_A: U11.32(PA11) ; port nSCS_A
PC14_A: R50.2 U11.3(PC14-OSC32_IN)
PC15_A: R49.2 U11.4(PC15-OSC32_OUT)
PD0_A: R51.2 U11.5(PD0-OSC_IN)
PD1_A: R53.2 U11.6(PD1-OSC_OUT)
PL_1: U29.27(GPA6) ; port DIGITAL1.PL_1
RE/DE/ENCD_1: U11.19(PB1) ; port RE/DE/ENCD_1
RST_1: R9.1 R11.1 U11.38(PA15) U29.18(~{RESET}) U30.18(~{RESET})
RXD-ENCD_1: U11.21(PB10) ; port RXD-ENCD_1
SDI_A: U11.41(PB5) ; port SDI_A
SDO_A: U11.40(PB4) ; port SDO_A
SIG_1: U29.2(GPB1) ; port SIG_1
SIG_2: U29.3(GPB2) ; port SIG_2
SOA_A: U11.15(PA5) ; port SOA_A
SOB_A: U11.16(PA6) ; port SOB_A
SOC_A: U11.17(PA7) ; port SOC_A
SON_1: U29.21(GPA0) ; port DIGITAL1.SON_1
SWCLK_A: J9.4 U11.37(PA14)
SWDIO_A: J9.3 U11.34(PA13)
SWO/SCK_A: J9.2 U11.39(PB3) ; port SWO/SCK_A
TCM0_1: U29.23(GPA2) ; port DIGITAL1.TCM0_1
TCM1_1: U29.24(GPA3) ; port DIGITAL1.TCM1_1
TXD-ENCD_1: U11.22(PB11) ; port TXD-ENCD_1
USART1_RXA: J8.3 U11.43(PB7)
USART1_TXA: J8.2 U11.42(PB6)
USART6_RX: U11.12(PA2) ; port USART6_RX
USART6_TX: U11.13(PA3) ; port USART6_TX
NetC35_1: C35.1 R49.1 X3.4(OSC2)
NetC36_2: C36.2 R50.1 X3.1(OSC1)
NetC37_1: C37.1 R51.1 X4.3(OSC2)
NetC38_1: C38.1 R53.1 X4.1(OSC1)
NetC43_2: C43.2 D13.2(K) L3.2 U11.9(VDDA)
NetJ10_1: J10.1 R52.1
NetR219_1: R219.1 U29.15(A0)

Not connected (* = marked no-connect by the designer): U11 2(PC13-TAMPER-RTC)* 14(PA4); U29 4(GPB3)* 5(GPB4)* 6(GPB5)* 7(GPB6)* 8(GPB7)* 11(NC)* 14(NC)* 19(INTB)* 20(INTA)* 28(GPA7)*; U30 6(GPB5)* 7(GPB6)* 8(GPB7)* 11(NC)* 14(NC)* 19(INTB)* 20(INTA)* 28(GPA7)*

### Notes on the sheet
- (near R49) 0R
- (near X3) 6.8pF
- (near R50) 0R
- (near X3) 32.768kHz
- (near C36) 6.8pF
- File:
- Title:
- Date:
- Page
- Num:
- Total:
- Drawn By: Huzaifa Ali

### Library data of the parts
C7 C190 = CC0402KRX5R6BB105: CAP CER 1UF 10V X5R 0402; Manufacturer: Yageo; Tolerance: 10%; Dissipation Factor: 15%; Item Type: Capacitor; Supplier 1: Mouser; Manufacturer Part Number: CC0402KRX5R6BB105; RoHS: Yes; Category: Ceramic Capacitors; Stock 1: 6711367; Pricing 1: 1=0.11000, 10=0.05500, 50=0.05500, 100=0.03300, 500=0.02700, 1000=0.02200, 2500=0.02100, 10000=0.01800 (USD); Mount: Surface Mount; Case/Package: 0402; Number of Pins: 2; Case Code (Metric): 1005; Case Code (Imperial): 0402; Min Operating Temperature: -55°C; Max Operating Temperature: 85°C; Capacitance: 1uF; Dielectric: X5R; Package Quantity: 1; Voltage Rating: 10V; Packaging: Tape and Reel; Voltage Rating (DC): 10V; Termination: SMD/SMT; Resistor Type: Ceramic; Series: CC; Construction: Flat; Length: 1mm; Width: 0.02inch; Height: 0.5mm; Thickness: 0.022inch; Depth: 0.5mm; Radiation Hardening: No; REACH SVHC: No SVHC; Lead Free: Lead Free; Halogen Free: Halogen Free; RoHS Compliant: Yes; ComponentLink1URL: https://datasheet.ciiva.com/176/upy-gphc-x5r-4v-to-50v-12-176704.pdf?src-supplier=Digi-Key; ComponentLink1Description: https://datasheet.ciiva.com/176/upy-gphc-x5r-4v-to-50v-12-176704.pdf?src-supplier=Digi-Key; ComponentLink2URL: https://datasheet.ciiva.com/176/mlccorderingcode-176705.pdf?src-supplier=Digi-Key; ComponentLink2Description: https://datasheet.ciiva.com/176/mlccorderingcode-176705.pdf?src-supplier=Digi-Key; ComponentLink3URL: https://datasheet.ciiva.com/176/mlccorderingcode-176706.pdf?src-supplier=Digi-Key; ComponentLink3Description: https://datasheet.ciiva.com/176/mlccorderingcode-176706.pdf?src-supplier=Digi-Key; Supplier Part Number 1: 603-CC402KRX5R6BB105; LCSC Part Number: C106254
C8 C39-C42 C191 = C1005X7R1H104KT000F: CAP CER 0.1UF 50V X7R 0402; Manufacturer: TDK; Tolerance: 10%; Voltage: 25V; Item Type: Capacitor; Supplier 1: Avnet; Manufacturer Part Number: C1005X7R1H104KT000F; RoHS: No; Category: Ceramic Capacitors; Dielectric: X7R; Supplier Part Number 1: C1005X7R1H104KT000F; LCSC Part Number: C361198; ComponentLink1Description: LCSC; ComponentLink1URL: https://www.lcsc.com/product-detail/Multilayer-Ceramic-Capacitors-MLCC-SMD-SMT_TDK-C1005X7R1H104KT000F_C361198.html
C34 C43 = CC0402JRX7R7BB104: CAP CER 0.1UF 16V X7R 0402; Manufacturer: Yageo; Material: 4241ConductorMaterial; Value: 100nF; Tolerance: 5%; Item Type: Capacitor; Supplier: Digikey; Supplier Part Number: 311-1676-1-ND; Manufacturer Part Number: CC0402JRX7R7BB104; RoHS: Yes; Category: Ceramic Capacitors; Stock: 1659111; Pricing: 1=0.1, 10=0.046, 50=0.0262, 100=0.0203, 500=0.01528, 1000=0.012, 2500=0.01091, 5000=0.01004 (USD); Mounting Technology: Surface Mount; Case/Package: 0402; Case Code (Metric): 1005; Case Code (Imperial): 0402; Min Operating Temperature: -55°C; Max Operating Temperature: 125°C; Dielectric: X7R; Packaging: Tape and Reel; Package Quantity: 10000; Voltage Rating (DC): 16V; Voltage Rating: 16V; Series: CC; Construction: Flat; Length: 0.039inch; Width: 0.02inch; Height: 0.5mm; Thickness: 0.022inch; Lead Free: Lead Free; Halogen Free: Halogen Free; RoHS Compliant: Yes; ComponentLink1URL: https://datasheet.ciiva.com/13210/upy-gphc-x7r-6-3v-to-50v-8-12304-13210152.pdf?src-supplier=Mouser; ComponentLink1Description: https://datasheet.ciiva.com/13210/upy-gphc-x7r-6-3v-to-50v-8-12304-13210152.pdf?src-supplier=Mouser; LCSC Part Number: C541464
C35 C36 = CC0402CRNPO9BN6R8: CAP CER 6.8PF 50V C0G/NPO 0402; Manufacturer: Yageo; Dielectric: C0G; Tolerance: 2%; Insulation Resistance: 10GR; Item Type: Capacitor; Supplier: Future Electronics; Supplier Part Number: 3247368; Manufacturer Part Number: CC0402CRNPO9BN6R8; RoHS: Yes; Category: Ceramic Capacitors; Stock: 200000; Pricing: 10000=0.0024, 40000=0.0022, 150000=0.0021, 400000=0.002, 1000000=0.0019 (USD); Mounting Technology: Surface Mount; Case/Package: 0402; Case Code (Imperial): 0402; Case Code (Metric): 1005; Weight: 2.3E-05oz; Min Operating Temperature: -55°C; Max Operating Temperature: 125°C; Value: 6.8pF; Packaging: Tape and Reel; Voltage Rating: 50V; Voltage Rating (DC): 50V; Termination: SMD/SMT; Series: CC; Construction: Flat; Length: 1mm; Width: 0.5mm; Height: 0.5mm; Depth: 0.5mm; Radiation Hardening: No; RoHS Compliant: Yes; ComponentLink1URL: https://datasheet.ciiva.com/11587/upy-gp-np0-16v-to-50v-8-11587182.pdf?src-supplier=Avnet; ComponentLink1Description: https://datasheet.ciiva.com/11587/upy-gp-np0-16v-to-50v-8-11587182.pdf?src-supplier=Avnet; LCSC Part Number: C189470
C37 C38 = CC0402JRNPO9BN200: CAP CER 20PF 50V C0G/NPO 0402; Manufacturer: Yageo; Item Type: Capacitor; Temperature Coefficient: 30ppm/°C; Supplier: Avnet; LCSC Part Number: C107000; Manufacturer Part Number: CC0402JRNPO9BN200; RoHS: Yes; Stock: 20000; Pricing: 10000=0.00221 (USD); Halogen Free: 5694HalogenFree; ComponentLink1URL: https://datasheet.ciiva.com/176/mlccorderingcode-176360.pdf?src-supplier=Digikey; ComponentLink1Description: https://datasheet.ciiva.com/176/mlccorderingcode-176360.pdf?src-supplier=Digikey; ComponentLink2URL: https://datasheet.ciiva.com/176/mlccorderingcode-176361.pdf?src-supplier=Digikey; ComponentLink2Description: https://datasheet.ciiva.com/176/mlccorderingcode-176361.pdf?src-supplier=Digikey; ComponentLink3URL: https://datasheet.ciiva.com/176/mlccorderingcode-176362.pdf?src-supplier=Digikey; ComponentLink3Description: https://datasheet.ciiva.com/176/mlccorderingcode-176362.pdf?src-supplier=Digikey; ComponentLink4URL: https://datasheet.ciiva.com/7656/1132289-7656614.pdf?src-supplier=Element14; ComponentLink4Description: https://datasheet.ciiva.com/7656/1132289-7656614.pdf?src-supplier=Element14; ComponentLink5URL: https://datasheet.ciiva.com/5427/upy-gp-np0-16v-to-50v-8-3714-5427769.pdf?src-supplier=Mouser; ComponentLink5Description: https://datasheet.ciiva.com/5427/upy-gp-np0-16v-to-50v-8-3714-5427769.pdf?src-supplier=Mouser
D13 = AZ3003-01G: TVS SURGE PROTECTOR 1-CH 3.3V; Manufacturer: Amazing; Item Type: Diode; Manufacturer Part Number: AZ3003-01G; Package: SOD-123; LCSC Part Number: -; ComponentLink1Description: Digikey; ComponentLink1URL: https://www.digikey.com/en/products/detail/amazing/AZ3003-01G/16615352?s=N4IgTCBcDaIIIC0DMAGFSC0KCMBxEAugL5A
J8 = PM2.54-1*4: 2mm 2.54mm Plugin 2.5A -40℃~+105℃ Straight 1x4P Top 8.5mm 4 Square Hole Plugin,P=2.54mm Female Headers ROHS; Manufacturer: ZHOURI; Manufacturer Part Number: PM2.54-1*4; Package: Plugin,P=2.54mm; LCSC Part Number: C5116530; Item Type: Female Header; ComponentLink1Description: LCSC; ComponentLink1URL: https://www.lcsc.com/product-detail/span-style-background-color-ff0-Female-span-Headers_ZHOURI-PM2-54-1-4_C5116530.html
J9 = X6511WV-06H-C60D30: Gold 250V 3A Straight Square Pins 2.5mm 6P 260℃ 6mm -40℃~+105℃ 3mm 2.54mm Plugin Black Brass 1x6P Plugin,P=2.54mm Pin Headers ROHS; Manufacturer: XKB; Item Type: Male Header; Manufacturer Part Number: X6511WV-06H-C60D30; Package: Plugin,P=2.54mm; LCSC Part Number: C706878; ComponentLink1Description: LCSC; ComponentLink1URL: https://www.lcsc.com/product-detail/Pin-Headers_XKB-Connectivity-X6511WV-06H-C60D30_C706878.html
J10 = 68000-103HLF: CONN HEADER VERT 3POS 2.54MM; Item Type: Male Header; Number of Positions: 3; Current Rating: 3A; Insulation Resistance: 5GR; Voltage Rating: 1.5kV; Contact Post Length: 2.41mm; LCSC Part Number: C168677; ComponentLink1Description: LCSC; Supplier: Avnet; Supplier Part Number: 88K1775; RoHS: No; Category: Headers and Wire Housings; Stock: 2805; Pricing: 1=0.395, 10=0.31, 25=0.29, 50=0.27, 100=0.25 (USD); Contact Plating: Gold,GXT; Contact Material: Bronze; Housing Material: Thermoplastic; Housing Color: Black; Min Operating Temperature: -65°C; Max Operating Temperature: 125°C; Number of Rows: 1; Termination: Through Hole; Packaging: Bulk; Number of Contacts: 3; Contact Gender: Male; Orientation: Straight; Max Voltage Rating (AC): 1.5kV; Package Quantity: 100; Series: 68000; Length: 7.62mm; Pitch: 2.54mm; Contact Mating Length: 5.84mm; Depth: 2.41mm; Radiation Hardening: No; Flammability Rating: UL94 V-0; Reach SVHC Compliant: No; ComponentLink2URL: https://datasheet.ciiva.com/46392/1914865-46392021.pdf?src-supplier=Element14; ComponentLink2Description: https://datasheet.ciiva.com/46392/1914865-46392021.pdf?src-supplier=Element14
L3 = BLM15AG601SN1D: FERRITE BEAD 600 OHM 0402 1LN; Manufacturer: Murata; Material: Steel,Ferrite; Impedance: 600R; Tolerance: 25%; Max DC Current: 300mA; DC Resistance (DCR): 520mR; Test Frequency: 100MHz; Number of Lines: 1; Shielding: Unshielded; DC Resistance-Max: 600mR; Supplier 1: Digi-Key; Manufacturer Part Number: BLM15AG601SN1D; RoHS: Yes; Category: Inductors; Stock 1: 4108655; Pricing 1: 1=0.10000, 10=0.06500, 25=0.05760, 50=0.05240, 100=0.04710, 250=0.03456, 500=0.02514, 1000=0.02461, 5000=0.01676 (USD); Case/Package: 0402; Number of Pins: 2; Core Material: Ferrite; Case Code (Metric): 1005; Case Code (Imperial): 0402; Min Operating Temperature: -55°C; Max Operating Temperature: 125°C; Package Quantity: 10000; Packaging: Tape and Reel; Current Rating: 300mA; Max Current Rating: 300mA; Termination: SMD/SMT; DC Current: 300mA; Frequency: 100MHz; Number of Circuits: 1; Series: BLM15AG_SN; Length: 1mm; Width: 0.5mm; Height: 0.5mm; Depth: 0.55mm; Radiation Hardening: No; REACH SVHC: No SVHC; Military Standard: Not; Lead Free: Lead Free; RoHS Compliant: Yes; ComponentLink1URL: https://datasheet.ciiva.com/11799/0900766b811b5866-11799226.pdf?src-supplier=RSComponents; ComponentLink1Description: https://datasheet.ciiva.com/11799/0900766b811b5866-11799226.pdf?src-supplier=RSComponents; ComponentLink2URL: https://datasheet.ciiva.com/41449/001172163-da-01-en-drossel-0402-600r-1-0x0-5mm-10000st-41449450.pdf?src-supplier=Conrad; ComponentLink2Description: https://datasheet.ciiva.com/41449/001172163-da-01-en-drossel-0402-600r-1-0x0-5mm-10000st-41449450.pdf?src-supplier=Conrad; ComponentLink3URL: https://datasheet.ciiva.com/29347/442210-da-01-en-chip-drossel-0402-600r-300ma-1-0x0-5mm-29347879.pdf?src-supplier=Conrad; ComponentLink3Description: https://datasheet.ciiva.com/29347/442210-da-01-en-chip-drossel-0402-600r-300ma-1-0x0-5mm-29347879.pdf?src-supplier=Conrad; ComponentLink4URL: https://datasheet.ciiva.com/1466/5144-1466744.pdf?src-supplier=Element14; ComponentLink4Description: https://datasheet.ciiva.com/1466/5144-1466744.pdf?src-supplier=Element14; ComponentLink5URL: https://datasheet.ciiva.com/1466/5144-1466745.pdf?src-supplier=Element14; ComponentLink5Description: https://datasheet.ciiva.com/1466/5144-1466745.pdf?src-supplier=Element14; ComponentLink6URL: https://datasheet.ciiva.com/14122/blm-series-eng-tds-14122894.pdf?src-supplier=Distrelec; ComponentLink6Description: https://datasheet.ciiva.com/14122/blm-series-eng-tds-14122894.pdf?src-supplier=Distrelec; ComponentLink7URL: https://datasheet.ciiva.com/6212/l0110s0100blm15ag-sn-6212519.pdf?src-supplier=Digi-Key; ComponentLink7Description: https://datasheet.ciiva.com/6212/l0110s0100blm15ag-sn-6212519.pdf?src-supplier=Digi-Key; ComponentLink8URL: https://datasheet.ciiva.com/6212/l0110s0100blm15ag-sn-6212565.pdf?src-supplier=Digi-Key; ComponentLink8Description: https://datasheet.ciiva.com/6212/l0110s0100blm15ag-sn-6212565.pdf?src-supplier=Digi-Key; ComponentLink9URL: https://datasheet.ciiva.com/6212/l0110s0100blm15ag-sn-6212520.pdf?src-supplier=Digi-Key; ComponentLink9Description: https://datasheet.ciiva.com/6212/l0110s0100blm15ag-sn-6212520.pdf?src-supplier=Digi-Key; ComponentLink10URL: https://datasheet.ciiva.com/8084/l0110s0100blm15ag-sn-8084271.pdf?src-supplier=Avnet; ComponentLink10Description: https://datasheet.ciiva.com/8084/l0110s0100blm15ag-sn-8084271.pdf?src-supplier=Avnet; ComponentLink11URL: https://datasheet.ciiva.com/8510/l0110s0100blm15ag-sn-8510909.pdf?src-supplier=Avnet; ComponentLink11Description: https://datasheet.ciiva.com/8510/l0110s0100blm15ag-sn-8510909.pdf?src-supplier=Avnet; Supplier Part Number 1: 490-1006-1-ND; LCSC Part Number: C76884; Item Type: Ferrite Bead
R9 R11 R52 R219 R342 = RC0402FR-0710KL: RES 10K OHM 1% 1/16W 0402; Manufacturer: Yageo; Resistance: 10kR; Voltage Rating (DC): 50V; Temperature Coefficient: 100ppm/°C; Power Rating: 62.5mW; Max Power Dissipation: 63mW; Item Type: Resistor; Supplier 1: Mouser; Manufacturer Part Number: RC0402FR-0710KL; RoHS: Yes; Category: Chip SMD Resistors; Stock 1: 18648329; Pricing 1: 1=0.10000, 10=0.01400, 50=0.01400, 100=0.00500, 1000=0.00300, 10000=0.00200 (USD); Case/Package: 0402; Number of Pins: 2; Case Code (Imperial): 0402; Case Code (Metric): 1005; Min Operating Temperature: -55°C; Max Operating Temperature: 155°C; Resistor Type: Thick Film; Tolerance: 1%; Packaging: Tape and Reel; Voltage Rating: 50V; Termination: SMD/SMT; Working Voltage: 50V; Number of Terminations: 2; Features: Moisture Resistant; Series: RC; Resistance Tolerance: 1%; Construction: Rectangular; Length: 1mm; Width: 0.5mm; Height: 0.32mm; Depth: 0.5mm; Lead Pitch: 0.2mm; REACH SVHC: No SVHC; Lead Free: Lead Free; RoHS Compliant: Yes; Military Standard: Not; ComponentLink1URL: https://datasheet.ciiva.com/7660/38568-7660787.pdf?src-supplier=Element14; ComponentLink1Description: https://datasheet.ciiva.com/7660/38568-7660787.pdf?src-supplier=Element14; ComponentLink2URL: https://datasheet.ciiva.com/7849/1686128-7849814.pdf?src-supplier=Element14; ComponentLink2Description: https://datasheet.ciiva.com/7849/1686128-7849814.pdf?src-supplier=Element14; ComponentLink3URL: https://datasheet.ciiva.com/7983/1018594-7983486.pdf?src-supplier=Element14; ComponentLink3Description: https://datasheet.ciiva.com/7983/1018594-7983486.pdf?src-supplier=Element14; ComponentLink4URL: https://datasheet.ciiva.com/22747/1018594-22747512.pdf?src-supplier=Element14; ComponentLink4Description: https://datasheet.ciiva.com/22747/1018594-22747512.pdf?src-supplier=Element14; ComponentLink5URL: https://datasheet.ciiva.com/12667/pyu-rc0402-51-rohs-l-6-r-12667067.pdf?src-supplier=Mouser; ComponentLink5Description: https://datasheet.ciiva.com/12667/pyu-rc0402-51-rohs-l-6-r-12667067.pdf?src-supplier=Mouser; ComponentLink6URL: https://datasheet.ciiva.com/7849/1784430-7849813.pdf?src-supplier=Element14; ComponentLink6Description: https://datasheet.ciiva.com/7849/1784430-7849813.pdf?src-supplier=Element14; ComponentLink7URL: https://datasheet.ciiva.com/7849/1784430-7849815.pdf?src-supplier=Element14; ComponentLink7Description: https://datasheet.ciiva.com/7849/1784430-7849815.pdf?src-supplier=Element14; Supplier Part Number 1: 603-RC0402FR-0710KL; LCSC Part Number: C60490
R48 = RC0402FR-070RL: RES 0 OHM JUMPER 1/16W 0402; Manufacturer: Yageo; Item Type: Resistors; Tolerance: 1%; Power Rating: 62.5mW; Voltage Rating: 50V; Temperature Coefficient: 200ppm/°C; Max Power Dissipation: 63mW; Supplier 1: Mouser; Manufacturer Part Number: RC0402FR-070RL; RoHS: Yes; Stock 1: 8556842; Pricing 1: 1=0.10000, 10=0.01400, 50=0.01400, 100=0.00600, 1000=0.00300, 5000=0.00200, 10000=0.00100 (USD); Mount: Surface Mount; Case/Package: 0402; Contact Plating: Tin,Matte; Case Code (Imperial): 0402; Case Code (Metric): 1005; Size Code: 0402; Min Operating Temperature: -55°C; Max Operating Temperature: 155°C; Resistance: 0R; Resistor Type: Thick Film; Packaging: Tape and Reel; Termination: SMD/SMT; Features: Moisture Resistant; Series: RC; Number of Terminations: 2; Length: 1mm; Width: 0.5mm; Height: 0.35mm; Radiation Hardening: No; Lead Free: Lead Free; RoHS Compliant: Yes; ComponentLink1URL: https://datasheet.ciiva.com/8896/pyu-rc0402-51-rohs-l-6-8896149.pdf?src-supplier=Avnet; ComponentLink1Description: https://datasheet.ciiva.com/8896/pyu-rc0402-51-rohs-l-6-8896149.pdf?src-supplier=Avnet; ComponentLink2URL: https://datasheet.ciiva.com/16790/pyu-rc0402-51-rohs-l-6-r-16790444.pdf?src-supplier=Future+Electronics; ComponentLink2Description: https://datasheet.ciiva.com/16790/pyu-rc0402-51-rohs-l-6-r-16790444.pdf?src-supplier=Future+Electronics; Supplier Part Number 1: 603-RC0402FR-070RL; LCSC Part Number: C106231
R49-R51 R53 = RC0603JR-070RL: RES 0 OHM JUMPER 1/10W 0603; Manufacturer: Yageo; Resistance: 0mR; Tolerance: 1%; Power Rating: 100mW; Voltage Rating (DC): 50V; Temperature Coefficient: 200ppm/°C; Resistance Tolerance: 5%; Item Type: Resistor; Supplier 1: Digi-Key; Manufacturer Part Number: RC0603JR-070RL; RoHS: Yes; Category: Chip SMD Resistors; Stock 1: 18081776; Pricing 1: 1=0.10000, 10=0.01700, 25=0.01240, 50=0.00960, 100=0.00700, 250=0.00536, 500=0.00430, 1000=0.00316 (USD); Case/Package: 0603; Number of Pins: 2; Contact Plating: Tin,Matte; Case Code (Imperial): 0603; Case Code (Metric): 1608; Size Code: 0603; Min Operating Temperature: -55°C; Max Operating Temperature: 155°C; Resistor Type: Thick Film; Packaging: Tape and Reel; Termination: SMD/SMT; Series: RC; Technology: THICK FILM; Package Quantity: 5000; Voltage Rating: 50V; Features: Moisture Resistant; Max Power Dissipation: 100mW; Number of Terminations: 2; Construction: Rectangular; Length: 1.6mm; Width: 0.8mm; Height: 0.45mm; Depth: 0.8mm; Radiation Hardening: No; Reach SVHC Compliant: No SVHC; Lead Free: Lead Free; RoHS Compliant: Yes; Military Standard: Not; Supplier Part Number 1: 311-0.0GRCT-ND; LCSC Part Number: C95177
SW2 = B3U-1000P: SWITCH TACTILE SPST-NO 0.05A 12V; Manufacturer: Omron; Mechanical Life: 200000Cycles; Operating Force: 1.5N; Throw Configuration: SPST; Current Rating: 50mA; Contact Resistance: 100mR; Illumination Type: Non-Illuminated,Illuminated; Switch Travel: 0.15mm; Switch Function: Off-Mom; Actuator Type: Standard; Actuator Length: 0.4mm; Ratings: Dust Proof,IP40; ComponentLink1URL: http://www.farnell.com/datasheets/60838.pdf?src-supplier=Farnell; ComponentLink1Description: http://www.farnell.com/datasheets/60838.pdf?src-supplier=Farnell; ComponentLink2URL: http://www.farnell.com/datasheets/60838.pdf?src-supplier=Element14; ComponentLink2Description: http://www.farnell.com/datasheets/60838.pdf?src-supplier=Element14; ComponentLink3URL: https://omronfs.omron.com/en_US/ecb/products/pdf/en-b3u.pdf?src-supplier=Digi-Key; ComponentLink3Description: https://omronfs.omron.com/en_US/ecb/products/pdf/en-b3u.pdf?src-supplier=Digi-Key; ComponentLink4URL: http://www.omron.com/ecb/products/pdf/en-b3u.pdf?src-supplier=Digi-Key; ComponentLink4Description: http://www.omron.com/ecb/products/pdf/en-b3u.pdf?src-supplier=Digi-Key; ComponentLink5URL: https://www.distrelec.biz/Web/Downloads/he/et/B3U_eng_datasheet.pdf?mime=application%2Fpdf&src-supplier=Distrelec; ComponentLink5Description: https://www.distrelec.biz/Web/Downloads/he/et/B3U_eng_datasheet.pdf?mime=application%2Fpdf&src-supplier=Distrelec; ComponentLink6URL: http://www.onlinecomponents.com/productFiles/mf-OM/en-b3u.pdf?src-supplier=Onlinecomponents.com; ComponentLink6Description: http://www.onlinecomponents.com/productFiles/mf-OM/en-b3u.pdf?src-supplier=Onlinecomponents.com; Supplier 1: Digi-Key; Manufacturer Part Number: B3U-1000P; Stock 1: 116454; Pricing 1: 1=1, 10=0.961, 25=0.9064, 50=0.7976, 100=0.7251, 250=0.68888, 500=0.67074, 1000=0.52571 (USD); Mount: Surface Mount; Weight: 0.000776oz; Contact Material: Silver; Min Operating Temperature: -25°C; Max Operating Temperature: 70°C; Packaging: Tape and Reel; Voltage Rating (DC): 12V; Package Quantity: 1; Max Current Rating: 50mA; Termination: SMD/SMT; Orientation: Straight; Max Voltage Rating (DC): 12V; Electrical Life: 200000Cycles; Insulation Resistance: 100MR; Contact Current Rating: 50mA; Length: 4mm; Height: 1.2mm; Depth: 2.5mm; Width: 3mm; REACH SVHC: Unknown; Lead Free: Lead Free; ComponentLink7URL: https://www.verical.com/server-webapp/html/getDatasheet?partID=552554&src-supplier=Verical; ComponentLink7Description: https://www.verical.com/server-webapp/html/getDatasheet?partID=552554&src-supplier=Verical; ComponentLink8URL: http://www.farnell.com/datasheets/1685550.pdf?src-supplier=Element14; ComponentLink8Description: http://www.farnell.com/datasheets/1685550.pdf?src-supplier=Element14; ComponentLink9URL: http://www.farnell.com/datasheets/2610940.pdf?src-supplier=Farnell; ComponentLink9Description: http://www.farnell.com/datasheets/2610940.pdf?src-supplier=Farnell; ComponentLink10URL: https://www.alliedelec.com/m/d/4c8a9ef82804fc3c241a13c1e298fd73.pdf?src-supplier=Allied+Electronics; ComponentLink10Description: https://www.alliedelec.com/m/d/4c8a9ef82804fc3c241a13c1e298fd73.pdf?src-supplier=Allied+Electronics; Supplier Part Number 1: SW1020DKR-ND; LCSC Part Number: C231329; Item Type: Switch
U11 = STM32F103CBT6: IC MCU 32BIT 128KB FLASH 48LQFP; Manufacturer: STMicroelectronics; RAM Size: 20KB; Max Power Dissipation: 363mW; Interface: I2C,SPI,USB,CAN,IrDA,UART,USART,LIN; Number of I/Os: 37; Number of Timers/Counters: 4; Max Supply Voltage: 3.6V; Number of PWM Channels: 12; Frequency: 72MHz; Number of ADC Channels: 10; Min Supply Voltage: 2V; Oscillator Type: Internal; Data Bus Width: 32b; Number of Bits: 32; Number of SPI Channels: 2; Watchdog Timer: Yes; Peripherals: POR,PWM,WDT,DMA,Temp Sensor,I2C; Core Architecture: ARM; Supplier: Mouser; Supplier Part Number: 511-STM32F103CBT6; Manufacturer Part Number: STM32F103CBT6; RoHS: Yes; Category: Microcontrollers; Stock: 3552; Pricing: 1=7.35, 10=6.65, 50=5.53, 100=5.49, 1000=4.31, 10000=4.25 (USD); Case/Package: LQFP; Pins: 48; Min Operating Temperature: -40°C; Max Operating Temperature: 85°C; Package Quantity: 250; Density: 128KB; Packaging: Tray; Number of Programmable I/O: 37; Clock Frequency: 72MHz; Number of I2C Channels: 2; Memory Format: FLASH; Termination: SMD/SMT; Address Bus Width: 32b; Memory Size: 128KB; Series: STM32 F1; Length: 7mm; Width: 7.2mm; Height: 1.45mm; Radiation Hardening: No; Reach SVHC Compliant: No; Lead Free: Lead Free; RoHS Compliant: Yes; ComponentLink1URL: https://datasheet.ciiva.com/23669/1714663-23669200.pdf?src-supplier=Newark; ComponentLink1Description: https://datasheet.ciiva.com/23669/1714663-23669200.pdf?src-supplier=Newark; ComponentLink2URL: https://datasheet.ciiva.com/15122/getdatasheetpartid-92132-15122195.pdf?src-supplier=Verical; ComponentLink2Description: https://datasheet.ciiva.com/15122/getdatasheetpartid-92132-15122195.pdf?src-supplier=Verical; ComponentLink3URL: https://datasheet.ciiva.com/5752/cd00161566-5752838.pdf?src-supplier=Farnell; ComponentLink3Description: https://datasheet.ciiva.com/5752/cd00161566-5752838.pdf?src-supplier=Farnell; ComponentLink4URL: https://datasheet.ciiva.com/14100/pustm-arm-microcont-stm32f103-en-14100509.pdf?src-supplier=Distrelec; ComponentLink4Description: https://datasheet.ciiva.com/14100/pustm-arm-microcont-stm32f103-en-14100509.pdf?src-supplier=Distrelec; ComponentLink5URL: https://datasheet.ciiva.com/1502/cd00161566-1502328.pdf?src-supplier=Digi-Key; ComponentLink5Description: https://datasheet.ciiva.com/1502/cd00161566-1502328.pdf?src-supplier=Digi-Key; ComponentLink6URL: https://datasheet.ciiva.com/4840/cd00161566-4840398.pdf?src-supplier=Mouser; ComponentLink6Description: https://datasheet.ciiva.com/4840/cd00161566-4840398.pdf?src-supplier=Mouser; ComponentLink7URL: https://datasheet.ciiva.com/16219/cd00161566-16219150.pdf?src-supplier=Future+Electronics; ComponentLink7Description: https://datasheet.ciiva.com/16219/cd00161566-16219150.pdf?src-supplier=Future+Electronics; Item Type: IC; LCSC Part Number: C8304
U29 U30 = MCP23017T-E/SS: IC XPNDR 1.7MHZ I2C 28SSOP; Manufacturer: Microchip; Operating Supply Voltage: 5.5V; Interface: I2C,Serial; Number of Channels: 1; Output Current: 25mA; Number of I/Os: 16; Power Dissipation: 700mW; Clock Frequency: 10MHz; Output Type: PUSH-PULL; Supply Current: 1mA; Supplier 1: Digi-Key; Manufacturer Part Number: MCP23017T-E/SS; RoHS: Yes; Category: Interface ICs; Stock 1: 26314; Pricing 1: 1=1.69, 25=1.4, 100=1.28 (USD); Mounting Technology: Surface Mount; Case/Package: SSOP; Pins: 28; Min Operating Temperature: -40°C; Max Operating Temperature: 125°C; Package Quantity: 2100; Series: -; Packaging: Tape and Reel; Frequency: 1.7MHz; Number of Bits: 16; Nominal Supply Voltage: 5.5V; Lead Free: Lead Free; RoHS Compliant: Yes; ComponentLink1URL: https://datasheet.ciiva.com/12267/21952b-12267583.pdf?src-supplier=Mouser; ComponentLink1Description: https://datasheet.ciiva.com/12267/21952b-12267583.pdf?src-supplier=Mouser; ComponentLink2URL: https://datasheet.ciiva.com/8128/21952b-8128586.pdf?src-supplier=Avnet; ComponentLink2Description: https://datasheet.ciiva.com/8128/21952b-8128586.pdf?src-supplier=Avnet; ComponentLink3URL: https://datasheet.ciiva.com/16454/filehandler-aspxddocname-en023709-16454267.pdf?src-supplier=Future+Electronics; ComponentLink3Description: https://datasheet.ciiva.com/16454/filehandler-aspxddocname-en023709-16454267.pdf?src-supplier=Future+Electronics; ComponentLink4URL: https://datasheet.ciiva.com/1780/21952b-1780738.pdf?src-supplier=Digi-Key; ComponentLink4Description: https://datasheet.ciiva.com/1780/21952b-1780738.pdf?src-supplier=Digi-Key; Supplier Part Number 1: MCP23017T-E/SSCT-ND; LCSC Part Number: C558584; Item Type: IC
X3 = MC-306 32.7680K-A0:ROHS: 32.768kHz 12.5pF ±20ppm MC-306 Crystals ROHS; Manufacturer: Seiko Epson; Value: 32.786kHz; Manufacturer Part Number: MC-306 32.7680K-A0:ROHS; Item Type: Crystal; LCSC Part Number: C2650464; ComponentLink1Description: LCSC; ComponentLink1URL: https://www.lcsc.com/product-detail/Crystals_Seiko-Epson-MC-306-32-7680K-A0-ROHS_C2650464.html
X4 = 5TJ480000XYLBC: 8MHz 18pF ±10ppm SMD5032-4P Crystals ROHS; Manufacturer: JYJE; Manufacturer Part Number: 5TJ480000XYLBC; ComponentLink1Description: LCSC; ComponentLink1URL: https://www.lcsc.com/product-detail/Crystals_JYJE-5TJ480000XYLBC_C2149247.html; Package: SMD5032-4P; LCSC Part Number: C2149247; Item Type: Crystal